# Altium schematic sheet Battery.SchDoc: Power
size A3; SheetNumber: 2; SheetTotal: 10
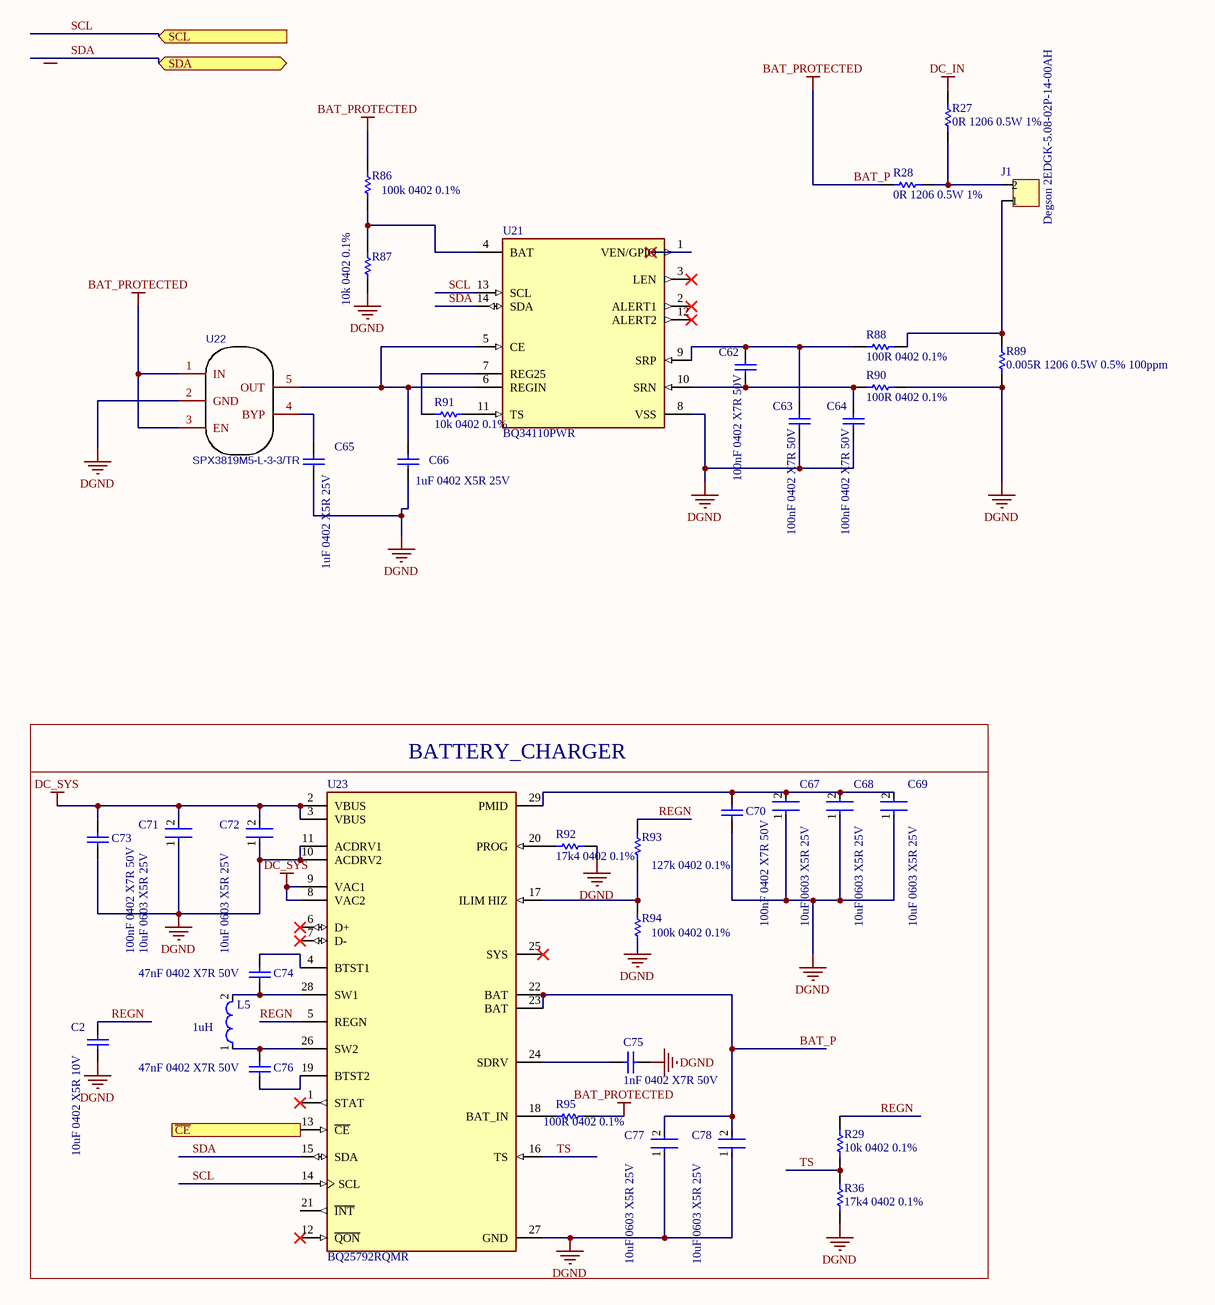
[diagram p0: Battery.SchDoc]

## Parts
C2  10uF 0402 X5R 10V  [CAPC1005X55X25NL5T10]
C62  100nF 0402 X7R 50V  [CAPC1005X55X25NL5T10]
C63  100nF 0402 X7R 50V  [CAPC1005X55X25NL5T10]
C64  100nF 0402 X7R 50V  [CAPC1005X55X25NL5T10]
C65  1uF 0402 X5R 25V  [CAPC1005X55X25NL5T10]
C66  1uF 0402 X5R 25V  [CAPC1005X55X25NL5T10]
C67  10uF 0603 X5R 25V  [FP-GRM188-0_2-IPC_B]
C68  10uF 0603 X5R 25V  [FP-GRM188-0_2-IPC_B]
C69  10uF 0603 X5R 25V  [FP-GRM188-0_2-IPC_B]
C70  100nF 0402 X7R 50V  [CAPC1005X55X25NL5T10]
C71  10uF 0603 X5R 25V  [FP-GRM188-0_2-IPC_B]
C72  10uF 0603 X5R 25V  [FP-GRM188-0_2-IPC_B]
C73  100nF 0402 X7R 50V  [CAPC1005X55X25NL5T10]
C74  47nF 0402 X7R 50V  [CAPC1005X55X25NL5T10]
C75  1nF 0402 X7R 50V  [CAPC1005X55X25NL5T10]
C76  47nF 0402 X7R 50V  [CAPC1005X55X25NL5T10]
C77  10uF 0603 X5R 25V  [FP-GRM188-0_2-IPC_B]
C78  10uF 0603 X5R 25V  [FP-GRM188-0_2-IPC_B]
J1  Degson 2EDGK-5.08-02P-14-00AH  [PCB-h4cyb3wxd4gf7j132tzl-1]
L5  Inductance: 1uH  [FP-DFE201612C-IPC_A]  (hidden comment: DFE201612E-1R0M=P2)
R27  0R 1206 0.5W 1%  [CAPC3216X180X55ML20T25]
R28  0R 1206 0.5W 1%  [CAPC3216X180X55ML20T25]
R29  10k 0402 0.1%  [RESC1005X40X25ML05T10]
R36  17k4 0402 0.1%  [RESC1005X40X25ML05T10]
R86  100k 0402 0.1%  [RESC1005X40X25ML05T10]
R87  10k 0402 0.1%  [RESC1005X40X25ML05T10]
R88  100R 0402 0.1%  [RESC1005X40X25ML05T10]
R89  0.005R 1206 0.5W 0.5% 100ppm  [CAPC3216X180X55ML20T25]
R90  100R 0402 0.1%  [RESC1005X40X25ML05T10]
R91  10k 0402 0.1%  [RESC1005X40X25ML05T10]
R92  17k4 0402 0.1%  [RESC1005X40X25ML05T10]
R93  127k 0402 0.1%  [RESC1005X40X25ML05T10]
R94  100k 0402 0.1%  [RESC1005X40X25ML05T10]
R95  100R 0402 0.1%  [RESC1005X40X25ML05T10]
U21  BQ34110PWR  [FP-PW0014A-MFG]
U22  SPX3819M5-L-3-3/TR  [SOT-23-5_L3.0-W1.7-P0.95-LS2.8-BR]
U23  BQ25792RQMR  [FP-RQM0029A-MFG]

## Blocks framed on the sheet
BATTERY_CHARGER: C2 C67-C78 L5 R29 R36 R92-R95 U23

## Ports
SCL (in), SDA (bidir), ~{CE} (in)

## Nets
BAT_P: C77.2 C78.2 R28.1 R86.2 R95.1 U22.1(IN) U22.3(EN) U23.22(BAT) U23.23(BAT)  [also labelled BAT_PROTECTED]
DC_IN: R27.1
DC_SYS: C71.2 C72.2 C73.2 U23.2(VBUS) U23.3(VBUS) U23.8(VAC2) U23.9(VAC1)
DGND: C2.1 C63.1 C64.1 C65.1 C66.1 C67.1 C68.1 C69.1 C70.1 C71.1 C72.1 C73.1 C75.1 C77.1 C78.1 R36.2 R87.1 R89.2 R90.1 R92.1 R94.1 U21.8(VSS) U22.2(GND) U23.10(ACDRV2) U23.11(ACDRV1) U23.27(GND)
~{CE}: U23.13(~{CE}) ; port ~{CE}
REGN: C2.2 R29.1 R93.2 U23.5(REGN)
SCL: U21.13(SCL) U23.14(SCL) ; port SCL
SDA: U21.14(SDA) U23.15(SDA) ; port SDA
TS: R29.2 R36.1 U23.16(TS)
NetC62_1: C62.1 C64.2 R90.2 U21.10(SRN)
NetC62_2: C62.2 C63.2 R88.2 U21.9(SRP)
NetC65_2: C65.2 U22.4(BYP)
NetC66_2: C66.2 U21.5(CE) U21.6(REGIN) U22.5(OUT)
NetC67_2: C67.2 C68.2 C69.2 C70.2 U23.29(PMID)
NetC74_1: C74.1 L5.2 U23.28(SW1)
NetC74_2: C74.2 U23.4(BTST1)
NetC75_2: C75.2 U23.24(SDRV)
NetC76_1: C76.1 U23.19(BTST2)
NetC76_2: C76.2 L5.1 U23.26(SW2)
NetJ1_1: J1.1 R88.1 R89.1
NetJ1_2: J1.2 R27.2 R28.2
NetR86_1: R86.1 R87.2 U21.4(BAT)
NetR91_1: R91.1 U21.11(TS)
NetR91_2: R91.2 U21.7(REG25)
NetR92_2: R92.2 U23.20(PROG)
NetR93_1: R93.1 R94.2 U23.17(ILIM_HIZ)
NetR95_2: R95.2 U23.18(BAT_IN)

Not connected (* = marked no-connect by the designer): U21 1(VEN/GPIO)* 2(ALERT1)* 3(LEN)* 12(ALERT2)*; U23 1(STAT)* 6(D+)* 7(D-)* 12(~{QON})* 21(~{INT}) 25(SYS)*

## Notes on the sheet
- Title
- Size:
- Date:
- A3
- Author:
- Time:
- Revision:
- Sheet
- of
- File:

## Library data of the parts
C2 C62-C66 C70 C73-C76 = CMP-1662-00020-1: ComponentLink2Description: Datasheet; ComponentLink2URL: http://psearch.en.murata.com/capacitor/product/GRM155R60J105KE19%23.pdf; ComponentLink1Description: Manufacturer URL; ComponentLink1URL: http://www.murata.com/
  C2: LCSC_PN: C77000
  C62-C64 C70 C73: LCSC_PN: C77020
  C65 C66: LCSC_PN: C77009
  C74 C76: LCSC_PN: C272875
  C75: LCSC_PN: C106205
C67-C69 C71 C72 C77 C78 = CMP-06035-022879-1: LCSC_PN: C91606
J1 = CMP-7a42b7ee166ba585-1: Terminal block, 5mm 2 Pos, through hole male.; Manufacturer Part Number: 2EDGK-5.08-02P-14-00AH + 2EDGVC-5.08-02P; Octopart URL: https://octopart.com/2edgk-5.08-02p-14-00ah-degson-78006607; OctopartID: 7a42b7ee166ba585; Manufacturer Part Number 2: WJ2EDGVC-5.08-2P + WJ2EDGK-5.08-2P; LCSC Part: C8445; LCSC_PN: C8445
L5 = CMP-06042-011635-1: Shielded Wirewound Inductor 1uH 20% 2900mA 0.048Ω 0806 (2016); LCSC_PN: C521238
R27 R28 = CMP-0abdc173b10ad57a-1: Manufacturer Part Number: WSLP12065L000FEA; Resistance: 0,002; Power: 1W; Octopart URL: https://octopart.com/1-2176055-0-te+connectivity-46440145; Case/Package: 1206; Lifecycle Status: Not Listed by Manufacturer; Packaging: Tape & Reel (TR); OctopartID: 0abdc173b10ad57a; OrderingCode: WSLP12065L000FEA; Manufacturer Part Number 2: FMF06FTHR005-LHL; LCSC_PN: C108081
R29 R36 R86-R88 R90-R95 = CMP-2002-07472-1
  R29 R87 R91: LCSC_PN: C190095
  R36 R92: LCSC_PN: C851231
  R86 R94: LCSC_PN: C60491
  R88 R90 R95: LCSC_PN: C106233
  R93: LCSC_PN: C138061
R89 = CMP-0abdc173b10ad57a-1: 0.002R 1206 0.5W 1%; Manufacturer Part Number: WSLP12065L000FEA; Resistance: 0,005; Power: 1W; Octopart URL: https://octopart.com/1-2176055-0-te+connectivity-46440145; Case/Package: 1206; Lifecycle Status: Not Listed by Manufacturer; Packaging: Tape & Reel (TR); OctopartID: 0abdc173b10ad57a; OrderingCode: WSLP12065L000FEA; Manufacturer Part Number 2: FMF06FTHR005-LHL; LCSC_PN: C723507
U21 = CMP-04911-000003-1: IC BATT MON MULTICELL 14TSSOP; Manufacturer: Texas Instruments; Number Of Outputs: 2; Max Junction Temp: +100°C; Max Supply Voltage: 4.5V; Min Supply Voltage: 2.45V; Number Of Cells: 4; Standoff Height: 0.05mm; Nominal Supply Current: 133uA; Package: PW0014A; Temperature Range High: +85°C; Octopart: https://octopart.com/bq34110pwr-texas+instruments-75529711; ComponentLink2URL: https://www.ti.com/lit/ds/symlink/bq34110.pdf; Device Class L1: Integrated Circuits (ICs); Height: 1.2mm; Device Class L3: Battery Management; Temperature Range Low: -40°C; RoHS: TRUE; Digikey Description: IC BATT MON MULTICELL 14TSSOP; Device Class L2: Power Management ICs; Manufacturer Part Number: BQ34110PWR; Lead Free: Yes; ComponentLink2Description: Datasheet; Category: IC; Automotive: No; Mouser Description: Multi-Chemistry High-Cell Count Battery Fuel Gauge With Integrated Rarely Discharged Module 14-TSSOP -40 to 85; Temperature: -40°C to +85°C; Ambient Temperature Range Low: -40°C; Ambient Temperature Range High: +85°C; LCSC_PN: C2877075
U22 = SPX3819M5-L-3-3/TR: BOM_Manufacturer: EXAR; BOM_Supplier: LCSC; BOM_Manufacturer Part: SPX3819M5-L-3-3/TR; BOM_Supplier Part: C9055; BOM_JLCPCB Part Class: Extended Part; spicePre: U; spiceSymbolName: SPX3819M5-L-3-3/TR; LCSC_PN: C9055
U23 = CMP-04911-000031-1: I2C CONTROLLED, 5-A, 1-4 CELL BU; RoHS Compliant: Yes; LCSC_PN: C2862876